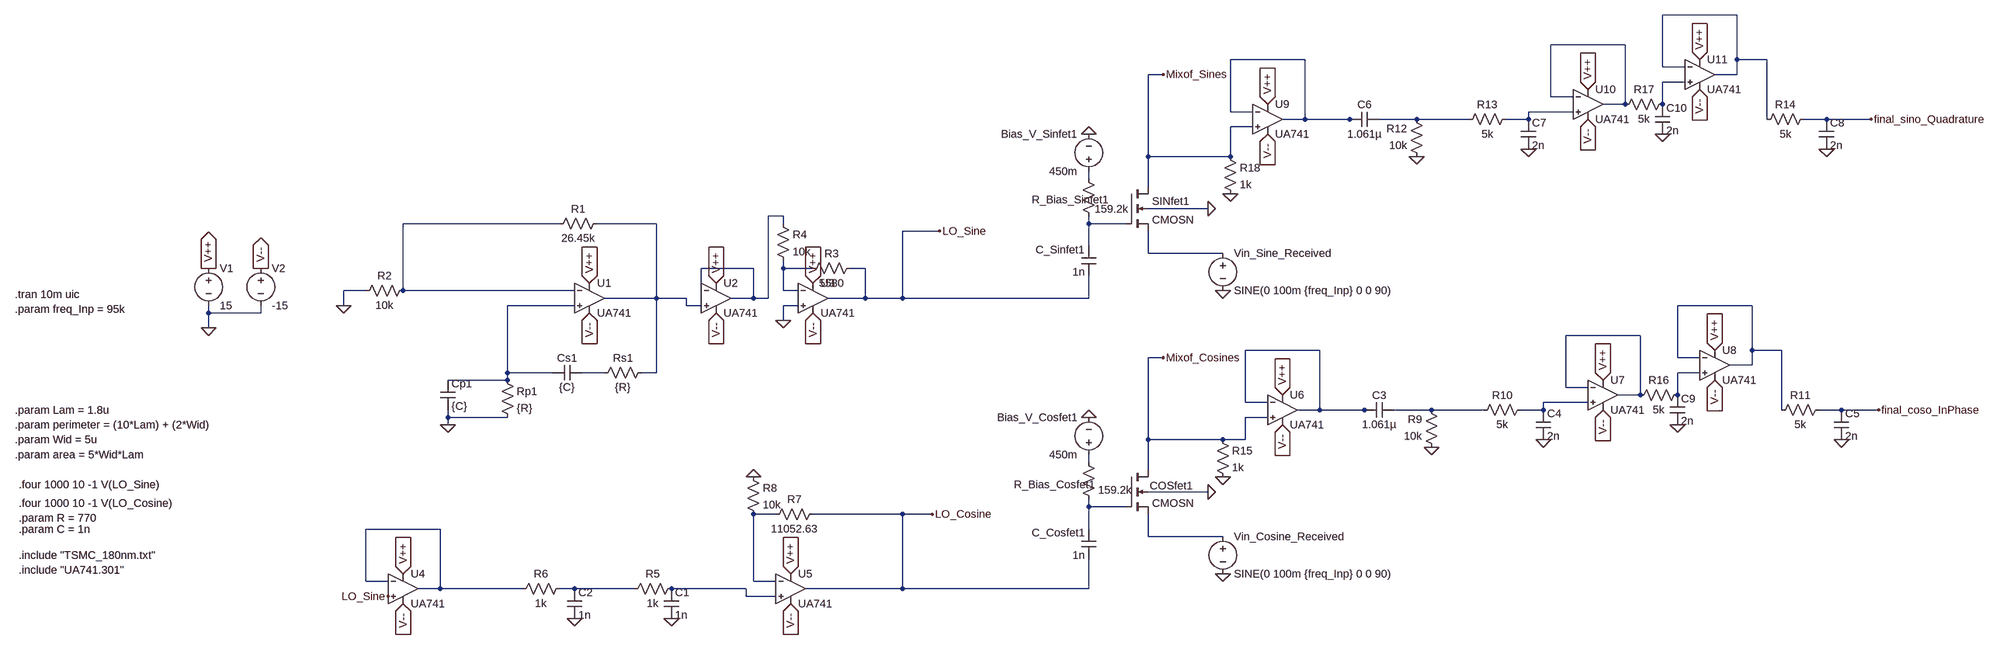
[diagram p0: schematic Draft3.asc]
Draft3.asc, the LTspice schematic file:
Version 4
SHEET 1 3496 816
WIRE 2928 -544 2768 -544
WIRE 2688 -480 2528 -480
WIRE 2000 -448 1840 -448
WIRE 2928 -448 2928 -544
WIRE 2992 -448 2928 -448
WIRE 2768 -432 2768 -544
WIRE 2816 -432 2768 -432
WIRE 1696 -416 1664 -416
WIRE 2928 -416 2928 -448
WIRE 2928 -416 2880 -416
WIRE 2816 -400 2768 -400
WIRE 2528 -368 2528 -480
WIRE 2576 -368 2528 -368
WIRE 2688 -352 2688 -480
WIRE 2688 -352 2640 -352
WIRE 2768 -352 2768 -400
WIRE 1840 -336 1840 -448
WIRE 1888 -336 1840 -336
WIRE 2576 -336 2480 -336
WIRE 2000 -320 2000 -448
WIRE 2000 -320 1952 -320
WIRE 2096 -320 2000 -320
WIRE 2112 -320 2096 -320
WIRE 2240 -320 2160 -320
WIRE 2352 -320 2240 -320
WIRE 2480 -320 2480 -336
WIRE 2480 -320 2432 -320
WIRE 2992 -320 2992 -448
WIRE 3120 -320 3072 -320
WIRE 3216 -320 3120 -320
WIRE 1888 -304 1840 -304
WIRE 1664 -240 1664 -416
WIRE 1840 -240 1840 -304
WIRE 1840 -240 1664 -240
WIRE 1536 -192 1536 -208
WIRE 1664 -176 1664 -240
WIRE 1792 -128 1664 -128
WIRE 880 -112 848 -112
WIRE 400 -96 64 -96
WIRE 608 -96 480 -96
WIRE 880 -96 880 -112
WIRE 1536 -96 1536 -112
WIRE 1616 -96 1536 -96
WIRE 1216 -80 1136 -80
WIRE 1536 -48 1536 -96
WIRE 1664 -32 1664 -80
WIRE 1824 -32 1664 -32
WIRE 816 0 704 0
WIRE 880 0 880 -16
WIRE 944 0 880 0
WIRE 1056 0 1024 0
WIRE -16 48 -64 48
WIRE 64 48 64 -96
WIRE 432 48 64 48
WIRE 704 48 704 0
WIRE 880 48 880 0
WIRE 912 48 880 48
WIRE 608 64 608 -96
WIRE 608 64 496 64
WIRE 672 64 608 64
WIRE 816 64 816 0
WIRE 816 64 768 64
WIRE 848 64 848 -112
WIRE 848 64 816 64
WIRE 1056 64 1056 0
WIRE 1056 64 976 64
WIRE 1136 64 1136 -80
WIRE 1136 64 1056 64
WIRE 1536 64 1536 16
WIRE 1536 64 1136 64
WIRE -64 80 -64 48
WIRE 432 80 288 80
WIRE 672 80 672 64
WIRE 704 80 672 80
WIRE 912 80 880 80
WIRE 2960 80 2800 80
WIRE -432 96 -432 80
WIRE -320 96 -320 80
WIRE -320 96 -432 96
WIRE 880 112 880 80
WIRE -432 128 -432 96
WIRE 2720 144 2560 144
WIRE 2032 176 1872 176
WIRE 2960 176 2960 80
WIRE 3024 176 2960 176
WIRE 1696 192 1664 192
WIRE 2800 192 2800 80
WIRE 2848 192 2800 192
WIRE 2960 208 2960 176
WIRE 2960 208 2912 208
WIRE 288 224 288 80
WIRE 384 224 288 224
WIRE 496 224 448 224
WIRE 608 224 608 64
WIRE 608 224 576 224
WIRE 2848 224 2800 224
WIRE 288 240 288 224
WIRE 288 240 160 240
WIRE 2560 256 2560 144
WIRE 2608 256 2560 256
WIRE 2720 272 2720 144
WIRE 2720 272 2672 272
WIRE 2800 272 2800 224
WIRE 1872 288 1872 176
WIRE 1920 288 1872 288
WIRE 2608 288 2512 288
WIRE 2032 304 2032 176
WIRE 2032 304 1984 304
WIRE 2128 304 2032 304
WIRE 2144 304 2128 304
WIRE 2272 304 2192 304
WIRE 2384 304 2272 304
WIRE 2512 304 2512 288
WIRE 2512 304 2464 304
WIRE 3024 304 3024 176
WIRE 3152 304 3104 304
WIRE 3232 304 3152 304
WIRE 160 320 160 304
WIRE 288 320 160 320
WIRE 1920 320 1872 320
WIRE 160 336 160 320
WIRE 1664 368 1664 192
WIRE 1824 368 1664 368
WIRE 1872 368 1872 320
WIRE 1872 368 1824 368
WIRE 1536 416 1536 400
WIRE 1664 432 1664 368
WIRE 1792 480 1664 480
WIRE 1536 512 1536 496
WIRE 1616 512 1536 512
WIRE 864 528 816 528
WIRE 1136 528 944 528
WIRE 1200 528 1136 528
WIRE 144 560 -16 560
WIRE 1536 560 1536 512
WIRE 1664 576 1664 528
WIRE 1824 576 1664 576
WIRE -16 672 -16 560
WIRE 32 672 -16 672
WIRE 816 672 816 528
WIRE 864 672 816 672
WIRE 144 688 144 560
WIRE 144 688 96 688
WIRE 320 688 144 688
WIRE 432 688 400 688
WIRE 560 688 432 688
WIRE 800 688 640 688
WIRE 1136 688 1136 528
WIRE 1136 688 928 688
WIRE 1536 688 1536 624
WIRE 1536 688 1136 688
WIRE 800 704 800 688
WIRE 864 704 800 704
FLAG 464 32 V++
IOPIN 464 32 In
FLAG 464 96 V--
IOPIN 464 96 In
FLAG 160 336 0
FLAG -64 80 0
FLAG 1216 -80 LO_Sine
FLAG -432 128 0
FLAG -432 0 V++
IOPIN -432 0 Out
FLAG -320 0 V--
IOPIN -320 0 Out
FLAG 736 32 V++
IOPIN 736 32 In
FLAG 736 96 V--
IOPIN 736 96 In
FLAG 944 32 V++
IOPIN 944 32 In
FLAG 944 96 V--
IOPIN 944 96 In
FLAG 880 112 0
FLAG 64 656 V++
IOPIN 64 656 In
FLAG 64 720 V--
IOPIN 64 720 In
FLAG 32 704 LO_Sine
FLAG 640 752 0
FLAG 432 752 0
FLAG 896 656 V++
IOPIN 896 656 In
FLAG 896 720 V--
IOPIN 896 720 In
FLAG 816 448 0
FLAG 1200 528 LO_Cosine
FLAG 1536 320 0
FLAG 1824 656 0
FLAG 1792 480 0
FLAG 1696 192 Mixof_Cosines
FLAG 3232 304 final_coso_InPhase
FLAG 2512 368 0
FLAG 2272 384 0
FLAG 3152 368 0
FLAG 1536 -288 0
FLAG 1824 48 0
FLAG 1792 -128 0
FLAG 1696 -416 Mixof_Sines
FLAG 3216 -320 final_sino_Quadrature
FLAG 1952 272 V++
IOPIN 1952 272 In
FLAG 1952 336 V--
IOPIN 1952 336 In
FLAG 2640 240 V++
IOPIN 2640 240 In
FLAG 2640 304 V--
IOPIN 2640 304 In
FLAG 2800 336 0
FLAG 2880 176 V++
IOPIN 2880 176 In
FLAG 2880 240 V--
IOPIN 2880 240 In
FLAG 1824 448 0
FLAG 2480 -256 0
FLAG 2240 -240 0
FLAG 3120 -256 0
FLAG 1920 -352 V++
IOPIN 1920 -352 In
FLAG 1920 -288 V--
IOPIN 1920 -288 In
FLAG 2608 -384 V++
IOPIN 2608 -384 In
FLAG 2608 -320 V--
IOPIN 2608 -320 In
FLAG 2768 -288 0
FLAG 2848 -448 V++
IOPIN 2848 -448 In
FLAG 2848 -384 V--
IOPIN 2848 -384 In
FLAG 1840 -160 0
SYMBOL OpAmps\\opamp2 464 0 R0
SYMATTR InstName U1
SYMATTR Value UA741
SYMBOL cap 144 240 R0
SYMATTR InstName Cp1
SYMATTR Value {C}
SYMBOL cap 448 208 R90
WINDOW 0 0 32 VBottom 2
WINDOW 3 32 32 VTop 2
SYMATTR InstName Cs1
SYMATTR Value {C}
SYMBOL res 272 224 R0
SYMATTR InstName Rp1
SYMATTR Value {R}
SYMBOL res 592 208 R90
WINDOW 0 0 56 VBottom 2
WINDOW 3 32 56 VTop 2
SYMATTR InstName Rs1
SYMATTR Value {R}
SYMBOL res 496 -112 R90
WINDOW 0 0 56 VBottom 2
WINDOW 3 32 56 VTop 2
SYMATTR InstName R1
SYMATTR Value 26.45k
SYMBOL res 80 32 R90
WINDOW 0 0 56 VBottom 2
WINDOW 3 32 56 VTop 2
SYMATTR InstName R2
SYMATTR Value 10k
SYMBOL voltage -432 -16 R0
WINDOW 123 0 0 Left 0
WINDOW 39 0 0 Left 0
SYMATTR InstName V1
SYMATTR Value 15
SYMBOL voltage -320 -16 R0
WINDOW 123 0 0 Left 0
WINDOW 39 0 0 Left 0
SYMATTR InstName V2
SYMATTR Value -15
SYMBOL OpAmps\\opamp2 736 0 R0
SYMATTR InstName U2
SYMATTR Value UA741
SYMBOL OpAmps\\opamp2 944 0 R0
SYMATTR InstName U3
SYMATTR Value UA741
SYMBOL res 1040 -16 R90
WINDOW 0 0 56 VBottom 2
WINDOW 3 32 56 VTop 2
SYMATTR InstName R3
SYMATTR Value 5580
SYMBOL res 864 -112 R0
SYMATTR InstName R4
SYMATTR Value 10k
SYMBOL OpAmps\\opamp2 64 624 R0
SYMATTR InstName U4
SYMATTR Value UA741
SYMBOL res 656 672 R90
WINDOW 0 0 56 VBottom 2
WINDOW 3 32 56 VTop 2
SYMATTR InstName R5
SYMATTR Value 1k
SYMBOL cap 624 688 R0
SYMATTR InstName C1
SYMATTR Value 1n
SYMBOL res 416 672 R90
WINDOW 0 0 56 VBottom 2
WINDOW 3 32 56 VTop 2
SYMATTR InstName R6
SYMATTR Value 1k
SYMBOL cap 416 688 R0
SYMATTR InstName C2
SYMATTR Value 1n
SYMBOL OpAmps\\opamp2 896 624 R0
SYMATTR InstName U5
SYMATTR Value UA741
SYMBOL res 960 512 R90
WINDOW 0 0 56 VBottom 2
WINDOW 3 32 56 VTop 2
SYMATTR InstName R7
SYMATTR Value 11052.63
SYMBOL res 800 432 R0
SYMATTR InstName R8
SYMATTR Value 10k
SYMBOL cap 1552 624 R180
WINDOW 0 24 56 Left 2
WINDOW 3 24 8 Left 2
SYMATTR InstName C_Cosfet1
SYMATTR Value 1n
SYMBOL res 1520 400 R0
WINDOW 0 -145 64 Left 2
SYMATTR InstName R_Bias_Cosfet1
SYMATTR Value 159.2k
SYMBOL voltage 1536 416 R180
WINDOW 0 24 96 Left 2
WINDOW 3 24 16 Left 2
WINDOW 123 0 0 Left 0
WINDOW 39 0 0 Left 0
SYMATTR InstName Bias_V_Cosfet1
SYMATTR Value 450m
SYMBOL nmos4 1616 432 R0
WINDOW 0 51 35 Left 2
SYMATTR InstName COSfet1
SYMATTR Value CMOSN
SYMATTR Value2 l={2*Lam} w={1*Wid} ad={5*Wid*Lam} as={5*Wid*Lam} pd={perimeter} ps={perimeter}
SYMBOL voltage 1824 560 R0
WINDOW 123 0 0 Left 0
WINDOW 39 0 0 Left 0
SYMATTR InstName Vin_Cosine_Received
SYMATTR Value SINE(0 100m {freq_Inp} 0 0 90)
SYMBOL res 2288 400 R180
WINDOW 0 36 76 Left 2
WINDOW 3 36 40 Left 2
SYMATTR InstName R9
SYMATTR Value 10k
SYMBOL cap 2192 288 R90
WINDOW 0 0 32 VBottom 2
WINDOW 3 32 32 VTop 2
SYMATTR InstName C3
SYMATTR Value 1.061µ
SYMBOL res 2480 288 R90
WINDOW 0 0 56 VBottom 2
WINDOW 3 32 56 VTop 2
SYMATTR InstName R10
SYMATTR Value 5k
SYMBOL cap 2496 304 R0
SYMATTR InstName C4
SYMATTR Value 2n
SYMBOL res 3120 288 R90
WINDOW 0 0 56 VBottom 2
WINDOW 3 32 56 VTop 2
SYMATTR InstName R11
SYMATTR Value 5k
SYMBOL cap 3136 304 R0
SYMATTR InstName C5
SYMATTR Value 2n
SYMBOL cap 1552 16 R180
WINDOW 0 24 56 Left 2
WINDOW 3 24 8 Left 2
SYMATTR InstName C_Sinfet1
SYMATTR Value 1n
SYMBOL res 1520 -208 R0
WINDOW 0 -106 61 Left 2
WINDOW 3 29 81 Left 2
SYMATTR InstName R_Bias_Sinfet1
SYMATTR Value 159.2k
SYMBOL voltage 1536 -192 R180
WINDOW 0 24 96 Left 2
WINDOW 3 24 16 Left 2
WINDOW 123 0 0 Left 0
WINDOW 39 0 0 Left 0
SYMATTR InstName Bias_V_Sinfet1
SYMATTR Value 450m
SYMBOL nmos4 1616 -176 R0
SYMATTR InstName SINfet1
SYMATTR Value CMOSN
SYMATTR Value2 l={2*Lam} w={1*Wid} ad={5*Wid*Lam} as={5*Wid*Lam} pd={perimeter} ps={perimeter}
SYMBOL voltage 1824 -48 R0
WINDOW 123 0 0 Left 0
WINDOW 39 0 0 Left 0
SYMATTR InstName Vin_Sine_Received
SYMATTR Value SINE(0 100m {freq_Inp} 0 0 90)
SYMBOL OpAmps\\opamp2 1952 240 R0
SYMATTR InstName U6
SYMATTR Value UA741
SYMBOL OpAmps\\opamp2 2640 208 R0
SYMATTR InstName U7
SYMATTR Value UA741
SYMBOL res 2816 256 R90
WINDOW 0 0 56 VBottom 2
WINDOW 3 32 56 VTop 2
SYMATTR InstName R16
SYMATTR Value 5k
SYMBOL cap 2784 272 R0
SYMATTR InstName C9
SYMATTR Value 2n
SYMBOL OpAmps\\opamp2 2880 144 R0
SYMATTR InstName U8
SYMATTR Value UA741
SYMBOL res 1808 352 R0
SYMATTR InstName R15
SYMATTR Value 1k
SYMBOL res 2256 -224 R180
WINDOW 0 36 76 Left 2
WINDOW 3 36 40 Left 2
SYMATTR InstName R12
SYMATTR Value 10k
SYMBOL cap 2160 -336 R90
WINDOW 0 0 32 VBottom 2
WINDOW 3 32 32 VTop 2
SYMATTR InstName C6
SYMATTR Value 1.061µ
SYMBOL res 2448 -336 R90
WINDOW 0 0 56 VBottom 2
WINDOW 3 32 56 VTop 2
SYMATTR InstName R13
SYMATTR Value 5k
SYMBOL cap 2464 -320 R0
SYMATTR InstName C7
SYMATTR Value 2n
SYMBOL res 3088 -336 R90
WINDOW 0 0 56 VBottom 2
WINDOW 3 32 56 VTop 2
SYMATTR InstName R14
SYMATTR Value 5k
SYMBOL cap 3104 -320 R0
SYMATTR InstName C8
SYMATTR Value 2n
SYMBOL OpAmps\\opamp2 1920 -384 R0
SYMATTR InstName U9
SYMATTR Value UA741
SYMBOL OpAmps\\opamp2 2608 -416 R0
SYMATTR InstName U10
SYMATTR Value UA741
SYMBOL res 2784 -368 R90
WINDOW 0 0 56 VBottom 2
WINDOW 3 32 56 VTop 2
SYMATTR InstName R17
SYMATTR Value 5k
SYMBOL cap 2752 -352 R0
SYMATTR InstName C10
SYMATTR Value 2n
SYMBOL OpAmps\\opamp2 2848 -480 R0
SYMATTR InstName U11
SYMATTR Value UA741
SYMBOL res 1824 -256 R0
SYMATTR InstName R18
SYMATTR Value 1k
TEXT -840 616 Left 2 !.include "TSMC_180nm.txt"
TEXT -840 648 Left 2 !.include "UA741.301"
TEXT -848 56 Left 2 !.tran 10m uic
TEXT -840 464 Left 2 !.four 1000 10 -1 V(LO_Sine)
TEXT -840 504 Left 2 !.four 1000 10 -1 V(LO_Cosine)
TEXT -840 536 Left 2 !.param R = 770
TEXT -840 560 Left 2 !.param C = 1n
TEXT -848 336 Left 2 !.param perimeter = (10*Lam) + (2*Wid)
TEXT -848 304 Left 2 !.param Lam = 1.8u
TEXT -848 368 Left 2 !.param Wid = 5u
TEXT -848 88 Left 2 !.param freq_Inp = 95k
TEXT -848 400 Left 2 !.param area = 5*Wid*Lam

The netlist it stands for:
* Draft3.asc
XU1 N014 N009 V++ V-- N010 UA741  ; pins In+ In- V+ V- OUT
Cp1 N014 0 {C}
Cs1 N018 N014 {C}
Rp1 N014 0 {R}
Rs1 N010 N018 {R}
R1 N010 N009 26.45k
R2 N009 0 10k
V1 V++ 0 15
V2 V-- 0 -15
XU2 N010 N008 V++ V-- N008 UA741  ; pins In+ In- V+ V- OUT
XU3 0 N013 V++ V-- LO_Sine UA741  ; pins In+ In- V+ V- OUT
R3 LO_Sine N013 5580
R4 N008 N013 10k
XU4 LO_Sine N025 V++ V-- N025 UA741  ; pins In+ In- V+ V- OUT
R5 N028 N027 1k
C1 N028 0 1n
R6 N027 N025 1k
C2 N027 0 1n
XU5 N028 N024 V++ V-- LO_Cosine UA741  ; pins In+ In- V+ V- OUT
R7 LO_Cosine N024 11052.63
R8 0 N024 10k
C_Cosfet1 LO_Cosine N023 1n
R_Bias_Cosfet1 N022 N023 159.2k
V§Bias_V_Cosfet1 N022 0 450m
M§COSfet1 Mixof_Cosines N023 N026 0 CMOSN l={2*Lam} w={1*Wid} ad={5*Wid*Lam} as={5*Wid*Lam} pd={perimeter} ps={perimeter}
Vin_Cosine_Received N026 0 SINE(0 100m {freq_Inp} 0 0 90)
R9 0 N021 10k
C3 N021 N017 1.061µ
R10 N020 N021 5k
C4 N020 0 2n
R11 final_coso_InPhase N015 5k
C5 final_coso_InPhase 0 2n
C_Sinfet1 LO_Sine N011 1n
R_Bias_Sinfet1 N007 N011 159.2k
V§Bias_V_Sinfet1 N007 0 450m
M§SINfet1 Mixof_Sines N011 N012 0 CMOSN l={2*Lam} w={1*Wid} ad={5*Wid*Lam} as={5*Wid*Lam} pd={perimeter} ps={perimeter}
Vin_Sine_Received N012 0 SINE(0 100m {freq_Inp} 0 0 90)
XU6 Mixof_Cosines N017 V++ V-- N017 UA741  ; pins In+ In- V+ V- OUT
XU7 N020 N016 V++ V-- N016 UA741  ; pins In+ In- V+ V- OUT
R16 N019 N016 5k
C9 N019 0 2n
XU8 N019 N015 V++ V-- N015 UA741  ; pins In+ In- V+ V- OUT
R15 Mixof_Cosines 0 1k
R12 0 N006 10k
C6 N006 N003 1.061µ
R13 N005 N006 5k
C7 N005 0 2n
R14 final_sino_Quadrature N001 5k
C8 final_sino_Quadrature 0 2n
XU9 Mixof_Sines N003 V++ V-- N003 UA741  ; pins In+ In- V+ V- OUT
XU10 N005 N002 V++ V-- N002 UA741  ; pins In+ In- V+ V- OUT
R17 N004 N002 5k
C10 N004 0 2n
XU11 N004 N001 V++ V-- N001 UA741  ; pins In+ In- V+ V- OUT
R18 Mixof_Sines 0 1k
.model NMOS NMOS
.model PMOS PMOS
.lib standard.mos
.include "TSMC_180nm.txt"
.include "UA741.301"
.tran 10m uic
.four 1000 10 -1 V(LO_Sine)
.four 1000 10 -1 V(LO_Cosine)
.param R = 770
.param C = 1n
.param perimeter = (10*Lam) + (2*Wid)
.param Lam = 1.8u
.param Wid = 5u
.param freq_Inp = 95k
.param area = 5*Wid*Lam
.backanno
.end